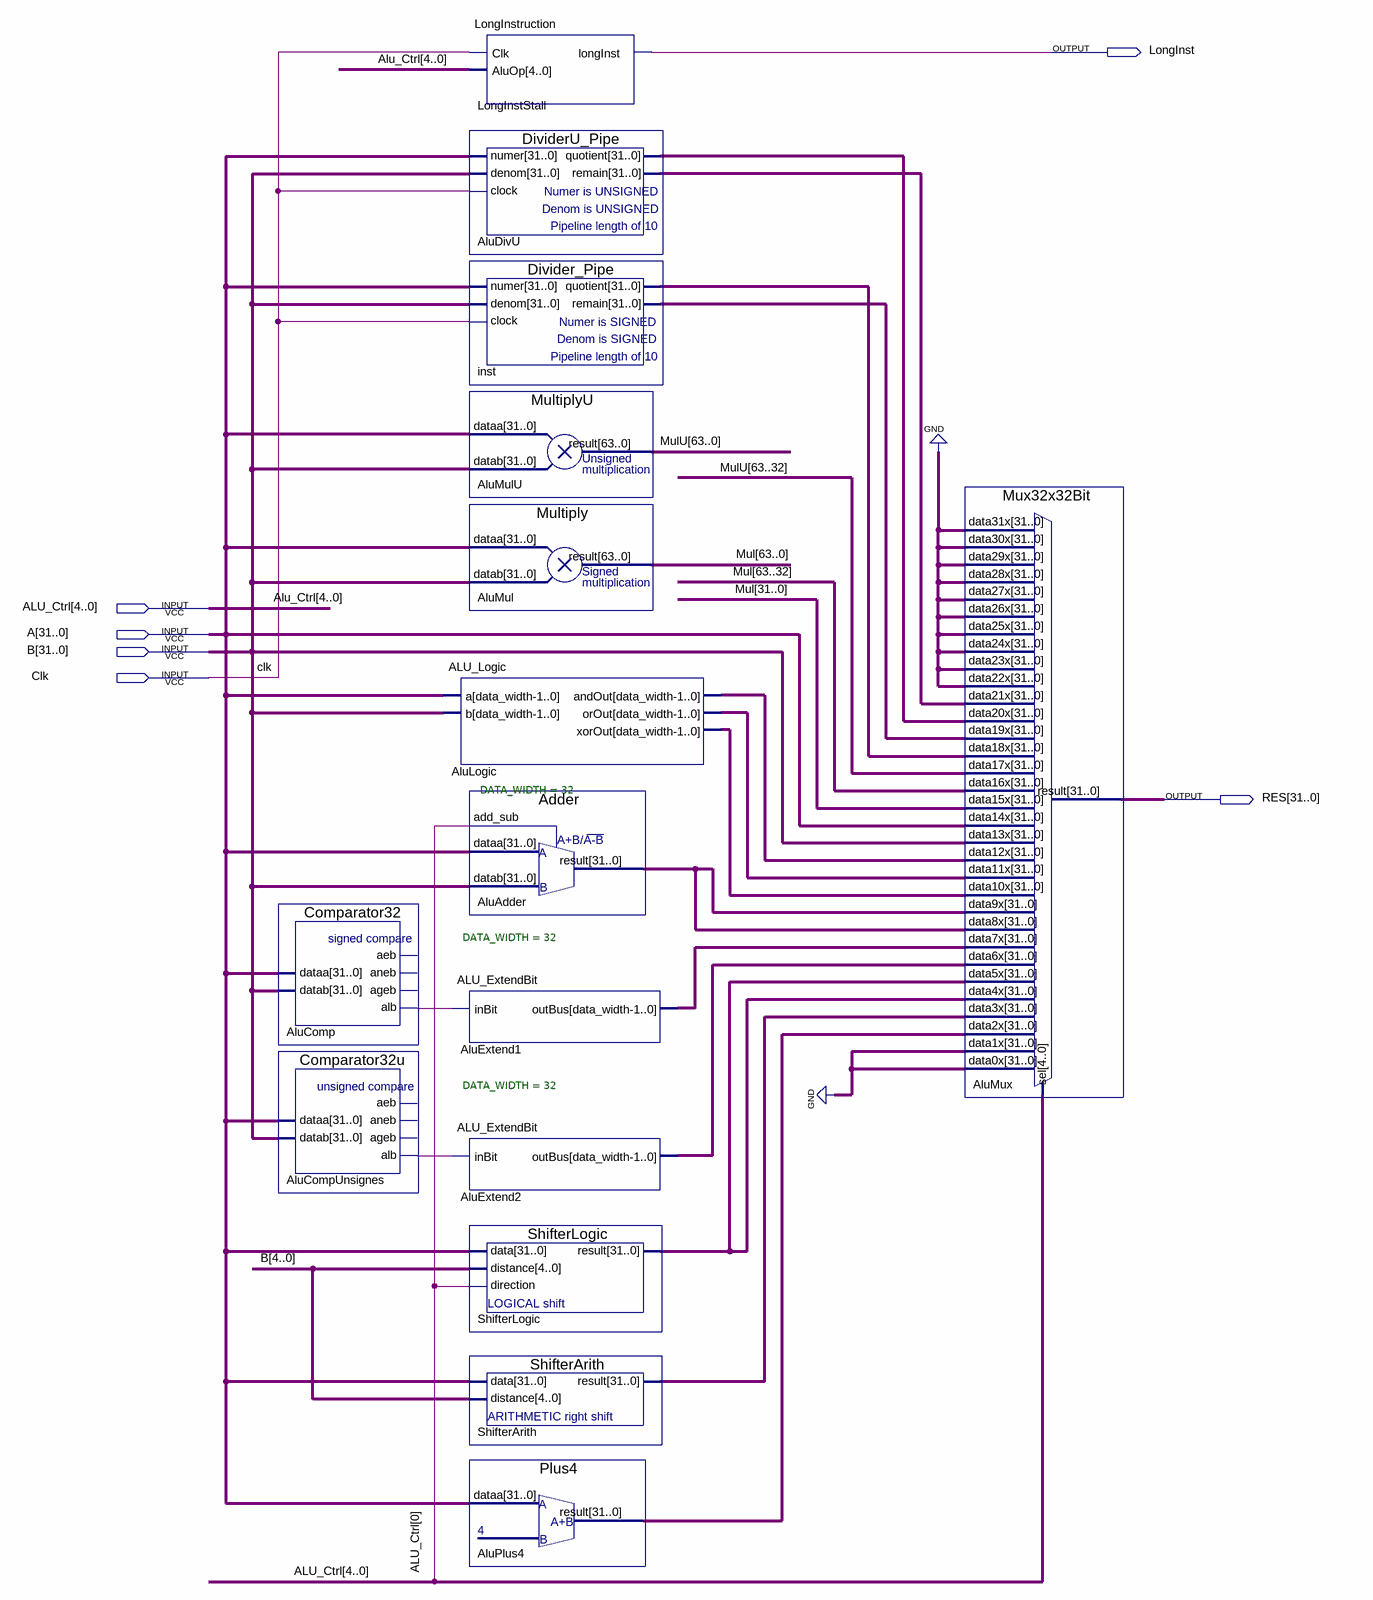
[diagram p0: schematic sheet]
// Quartus schematic ExecuteALU.bdf as structural Verilog: 15 symbols, 6 pins
module ExecuteALU (
  input  [4:0] ALU_Ctrl,
  input  [31:0] A,
  input  [31:0] B,
  input  Clk,
  output LongInst,
  output [31:0] RES
);

  wire AluComp_alb, AluCompUnsignes_alb;
  wire [31:0] AluAdder_result, AluDivU_quotient, AluDivU_remain, AluExtend1_outbus, AluExtend2_outbus,
       AluLogic_andout, AluLogic_orout, AluLogic_xorout, AluPlus4_result, inst_quotient, inst_remain,
       ShifterArith_result, ShifterLogic_result;
  wire [63:0] Mul, MulU;

  Comparator32 AluComp (.dataa(A), .datab(B), .alb(AluComp_alb));  // open: aeb, aneb, ageb
  Comparator32u AluCompUnsignes (.dataa(A), .datab(B), .alb(AluCompUnsignes_alb));  // open: aeb, aneb, ageb
  LongInstruction LongInstStall (.Clk(Clk), .AluOp(ALU_Ctrl), .longInst(LongInst));
  DividerU_Pipe AluDivU (.numer(A), .denom(B), .clock(Clk), .quotient(AluDivU_quotient), .remain(AluDivU_remain));
  Divider_Pipe inst (.numer(A), .denom(B), .clock(Clk), .quotient(inst_quotient), .remain(inst_remain));
  MultiplyU AluMulU (.dataa(A), .datab(B), .result(MulU));
  Multiply AluMul (.dataa(A), .datab(B), .result(Mul));
  ALU_Logic #(.DATA_WIDTH(32)) AluLogic (
    .a(A), .b(B), .andOut(AluLogic_andout), .orOut(AluLogic_orout), .xorOut(AluLogic_xorout));
  Adder AluAdder (.add_sub(ALU_Ctrl[0]), .dataa(A), .datab(B), .result(AluAdder_result));
  ALU_ExtendBit #(.DATA_WIDTH(32)) AluExtend1 (.inBit(AluComp_alb), .outBus(AluExtend1_outbus));
  ALU_ExtendBit #(.DATA_WIDTH(32)) AluExtend2 (.inBit(AluCompUnsignes_alb), .outBus(AluExtend2_outbus));
  ShifterLogic ShifterLogic (.data(A), .distance(B[4:0]), .direction(ALU_Ctrl[0]), .result(ShifterLogic_result));
  ShifterArith ShifterArith (.data(A), .distance(B[4:0]), .result(ShifterArith_result));
  Plus4 AluPlus4 (.dataa(A), .result(AluPlus4_result));
  Mux32x32Bit AluMux (
    .data31x({32{1'b0}}), .data30x({32{1'b0}}), .data29x({32{1'b0}}), .data28x({32{1'b0}}),
    .data27x({32{1'b0}}), .data26x({32{1'b0}}), .data25x({32{1'b0}}), .data24x({32{1'b0}}),
    .data23x({32{1'b0}}), .data22x({32{1'b0}}), .data21x(AluDivU_remain), .data20x(AluDivU_quotient),
    .data19x(inst_remain), .data18x(inst_quotient), .data17x(MulU[63:32]), .data16x(Mul[63:32]),
    .data15x(Mul[31:0]), .data14x(A), .data13x(B), .data12x(AluLogic_andout), .data11x(AluLogic_orout),
    .data10x(AluLogic_xorout), .data9x(AluAdder_result), .data8x(AluAdder_result),
    .data7x(AluExtend1_outbus), .data6x(AluExtend2_outbus), .data5x(ShifterLogic_result),
    .data4x(ShifterLogic_result), .data3x(ShifterArith_result), .data2x(AluPlus4_result),
    .data1x({32{1'b0}}), .data0x({32{1'b0}}), .sel(ALU_Ctrl), .result(RES));
endmodule
